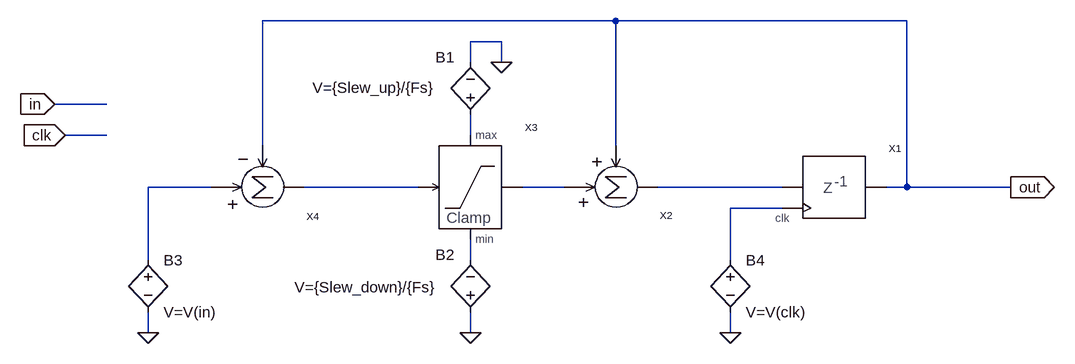
[diagram p0: schematic Slew.asc]
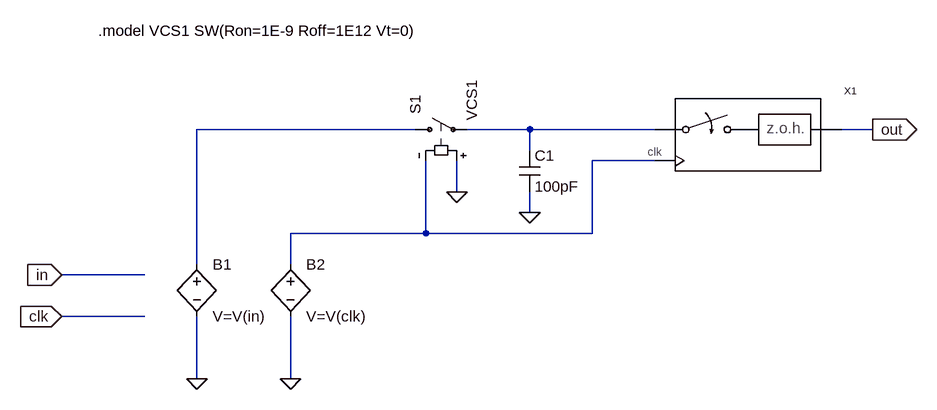
[diagram p1: sub-circuit delay.asc]
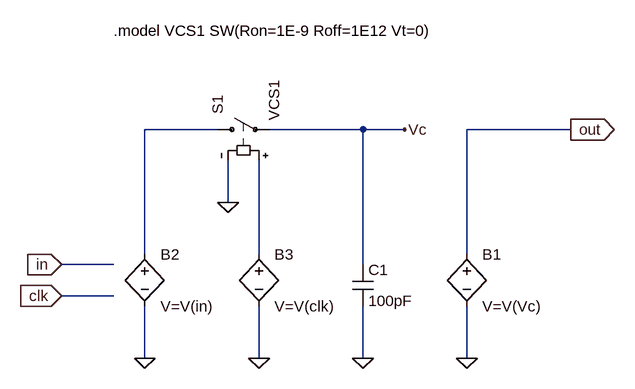
[diagram p2: sub-circuit s&h.asc]
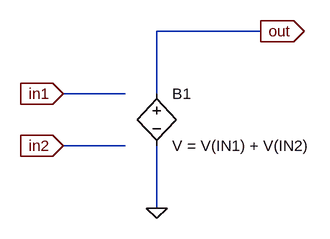
[diagram p3: sub-circuit adder.asc]
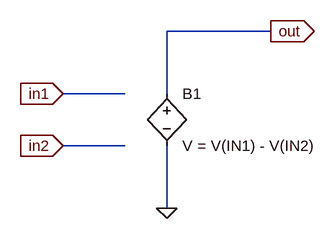
[diagram p4: sub-circuit subtractor.asc]
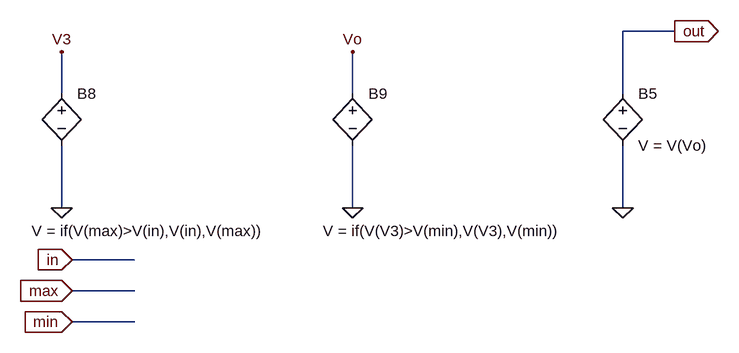
[diagram p5: sub-circuit clamp.asc]
Slew.asc, the LTspice schematic file:
Version 4
SHEET 1 880 872
WIRE 96 -16 -448 -16
WIRE 544 -16 96 -16
WIRE -80 16 -128 16
WIRE -128 48 -128 16
WIRE -80 48 -80 16
WIRE -688 112 -768 112
WIRE -688 160 -752 160
WIRE -128 160 -128 128
WIRE -448 176 -448 -16
WIRE 96 176 96 -16
WIRE -528 240 -624 240
WIRE -208 240 -384 240
WIRE 16 240 -48 240
WIRE 352 240 160 240
WIRE 544 240 544 -16
WIRE 544 240 512 240
WIRE 704 240 544 240
WIRE 352 272 272 272
WIRE -624 352 -624 240
WIRE -128 352 -128 320
WIRE 272 352 272 272
WIRE -624 464 -624 432
WIRE -128 464 -128 432
WIRE 272 464 272 432
FLAG -768 112 in
IOPIN -768 112 In
FLAG 704 240 out
IOPIN 704 240 Out
FLAG -752 160 clk
IOPIN -752 160 In
FLAG -80 48 0
FLAG -128 464 0
FLAG -624 464 0
FLAG 272 464 0
SYMBOL Delay 432 240 R0
SYMATTR InstName X1
SYMBOL Adder 96 240 M180
SYMATTR InstName X2
SYMBOL Subtractor -448 240 M180
SYMATTR InstName X4
SYMBOL Clamp -128 240 R0
SYMATTR InstName X3
SYMBOL bv -128 144 R180
WINDOW 0 24 104 Left 0
WINDOW 3 54 57 Left 0
SYMATTR InstName B1
SYMATTR Value V={Slew_up}/{Fs}
SYMBOL bv -128 448 R180
WINDOW 0 24 104 Left 0
WINDOW 3 51 54 Left 0
SYMATTR InstName B2
SYMATTR Value V={Slew_down}/{Fs}
SYMBOL bv -624 336 R0
SYMATTR InstName B3
SYMATTR Value V=V(in)
SYMBOL bv 272 336 R0
SYMATTR InstName B4
SYMATTR Value V=V(clk)

delay.asc, the sub-circuit schematic file:
Version 4
SHEET 1 1252 680
WIRE 416 48 80 48
WIRE 592 48 496 48
WIRE 784 48 592 48
WIRE 1120 48 1072 48
WIRE 592 80 592 48
WIRE 784 96 688 96
WIRE 480 144 480 96
WIRE 592 176 592 144
WIRE 432 208 432 96
WIRE 432 208 224 208
WIRE 688 208 688 96
WIRE 688 208 432 208
WIRE 80 256 80 48
WIRE 224 256 224 208
WIRE 0 272 -128 272
WIRE 0 336 -128 336
WIRE 80 432 80 336
WIRE 224 432 224 336
FLAG 592 176 0
FLAG 480 144 0
FLAG -128 272 in
IOPIN -128 272 In
FLAG -128 336 clk
IOPIN -128 336 In
FLAG 80 432 0
FLAG 224 432 0
FLAG 1120 48 out
IOPIN 1120 48 Out
SYMBOL sw 400 48 R270
WINDOW 3 13 103 Left 0
SYMATTR Value VCS1
SYMATTR InstName S1
SYMBOL cap 576 80 R0
SYMATTR InstName C1
SYMATTR Value 100pF
SYMBOL S&H 928 48 R0
SYMATTR InstName X1
SYMBOL bv 80 240 R0
SYMATTR InstName B1
SYMATTR Value V=V(in)
SYMBOL bv 224 240 R0
SYMATTR InstName B2
SYMATTR Value V=V(clk)
TEXT -72 -104 Left 0 !.model VCS1 SW(Ron=1E-9 Roff=1E12 Vt=0)

s&h.asc, the sub-circuit schematic file:
Version 4
SHEET 1 880 680
WIRE -16 0 -128 0
WIRE 208 0 64 0
WIRE 272 0 208 0
WIRE 528 0 368 0
WIRE 0 112 0 48
WIRE -128 192 -128 0
WIRE 48 192 48 48
WIRE 368 192 368 0
WIRE -176 208 -256 208
WIRE 208 208 208 0
WIRE -176 256 -256 256
WIRE -128 352 -128 272
WIRE 48 352 48 272
WIRE 208 352 208 272
WIRE 368 352 368 272
FLAG 0 112 0
FLAG 208 352 0
FLAG 368 352 0
FLAG 272 0 Vc
FLAG -256 208 in
IOPIN -256 208 In
FLAG -256 256 clk
IOPIN -256 256 In
FLAG -128 352 0
FLAG 48 352 0
FLAG 528 0 out
IOPIN 528 0 Out
SYMBOL sw -32 0 R270
WINDOW 3 13 103 Left 0
SYMATTR Value VCS1
SYMATTR InstName S1
SYMBOL cap 192 208 R0
SYMATTR InstName C1
SYMATTR Value 100pF
SYMBOL bv 368 176 R0
SYMATTR InstName B1
SYMATTR Value V=V(Vc)
SYMBOL bv -128 176 R0
SYMATTR InstName B2
SYMATTR Value V=V(in)
SYMBOL bv 48 176 R0
SYMATTR InstName B3
SYMATTR Value V=V(clk)
TEXT -176 -152 Left 0 !.model VCS1 SW(Ron=1E-9 Roff=1E12 Vt=0)

adder.asc, the sub-circuit schematic file:
Version 4
SHEET 1 880 680
WIRE 640 32 480 32
WIRE 432 128 336 128
WIRE 480 128 480 32
WIRE 432 208 336 208
WIRE 480 304 480 208
FLAG 336 208 in2
IOPIN 336 208 In
FLAG 336 128 in1
IOPIN 336 128 In
FLAG 480 304 0
FLAG 640 32 out
IOPIN 640 32 Out
SYMBOL bv 480 112 R0
SYMATTR InstName B1
SYMATTR Value V = V(IN1) + V(IN2)

subtractor.asc, the sub-circuit schematic file:
Version 4
SHEET 1 880 680
WIRE 640 32 480 32
WIRE 416 128 320 128
WIRE 480 128 480 32
WIRE 416 208 320 208
WIRE 480 304 480 208
FLAG 320 208 in2
IOPIN 320 208 In
FLAG 320 128 in1
IOPIN 320 128 In
FLAG 480 304 0
FLAG 640 32 out
IOPIN 640 32 Out
SYMBOL bv 480 112 R0
SYMATTR InstName B1
SYMATTR Value V = V(IN1) - V(IN2)

clamp.asc, the sub-circuit schematic file:
Version 4
SHEET 1 1072 680
WIRE 976 -720 896 -720
WIRE 32 -624 32 -688
WIRE 480 -624 480 -688
WIRE 896 -624 896 -720
WIRE 32 -448 32 -544
WIRE 480 -448 480 -544
WIRE 896 -448 896 -544
WIRE 144 -368 48 -368
WIRE 144 -320 48 -320
WIRE 144 -272 48 -272
FLAG 48 -368 in
IOPIN 48 -368 In
FLAG 48 -320 max
IOPIN 48 -320 In
FLAG 48 -272 min
IOPIN 48 -272 In
FLAG 896 -448 0
FLAG 976 -720 out
IOPIN 976 -720 Out
FLAG 32 -448 0
FLAG 32 -688 V3
FLAG 480 -448 0
FLAG 480 -688 Vo
SYMBOL bv 896 -640 R0
SYMATTR InstName B5
SYMATTR Value V = V(Vo)
SYMBOL bv 32 -640 R0
WINDOW 3 -46 228 Left 0
SYMATTR Value V = if(V(max)>V(in),V(in),V(max))
SYMATTR InstName B8
SYMBOL bv 480 -640 R0
WINDOW 3 -46 228 Left 0
SYMATTR Value V = if(V(V3)>V(min),V(V3),V(min))
SYMATTR InstName B9

The netlist it stands for:
* Slew.asc
XX1 N005 out N006 delay
XX2 N004 out N005 adder
XX4 N002 out N003 subtractor
XX3 N003 N001 N007 N004 clamp
B1 N001 0 V={Slew_up}/{Fs}
B2 0 N007 V={Slew_down}/{Fs}
B3 N002 0 V=V(in)
B4 N006 0 V=V(clk)

* block symbol definitions
.subckt delay in out clk
S1 N001 N002 0 N003 VCS1
C1 N002 0 100pF
XX1 N002 N003 out s&h
B1 N001 0 V=V(in)
B2 N003 0 V=V(clk)
.model VCS1 SW(Ron=1E-9 Roff=1E12 Vt=0)
.ends delay

.subckt s&h in clk out
S1 N001 Vc N002 0 VCS1
C1 Vc 0 100pF
B1 out 0 V=V(Vc)
B2 N001 0 V=V(in)
B3 N002 0 V=V(clk)
.model VCS1 SW(Ron=1E-9 Roff=1E12 Vt=0)
.ends s&h

.subckt adder in1 in2 out
B1 out 0 V = V(IN1) + V(IN2)
.ends adder

.subckt subtractor in1 in2 out
B1 out 0 V = V(IN1) - V(IN2)
.ends subtractor

.subckt clamp in max min out
B5 out 0 V = V(Vo)
B8 V3 0 V = if(V(max)>V(in),V(in),V(max))
B9 Vo 0 V = if(V(V3)>V(min),V(V3),V(min))
.ends clamp

.backanno
.end